# EAGLE design AccessPanelV3 (EAGLE 7.7.0)
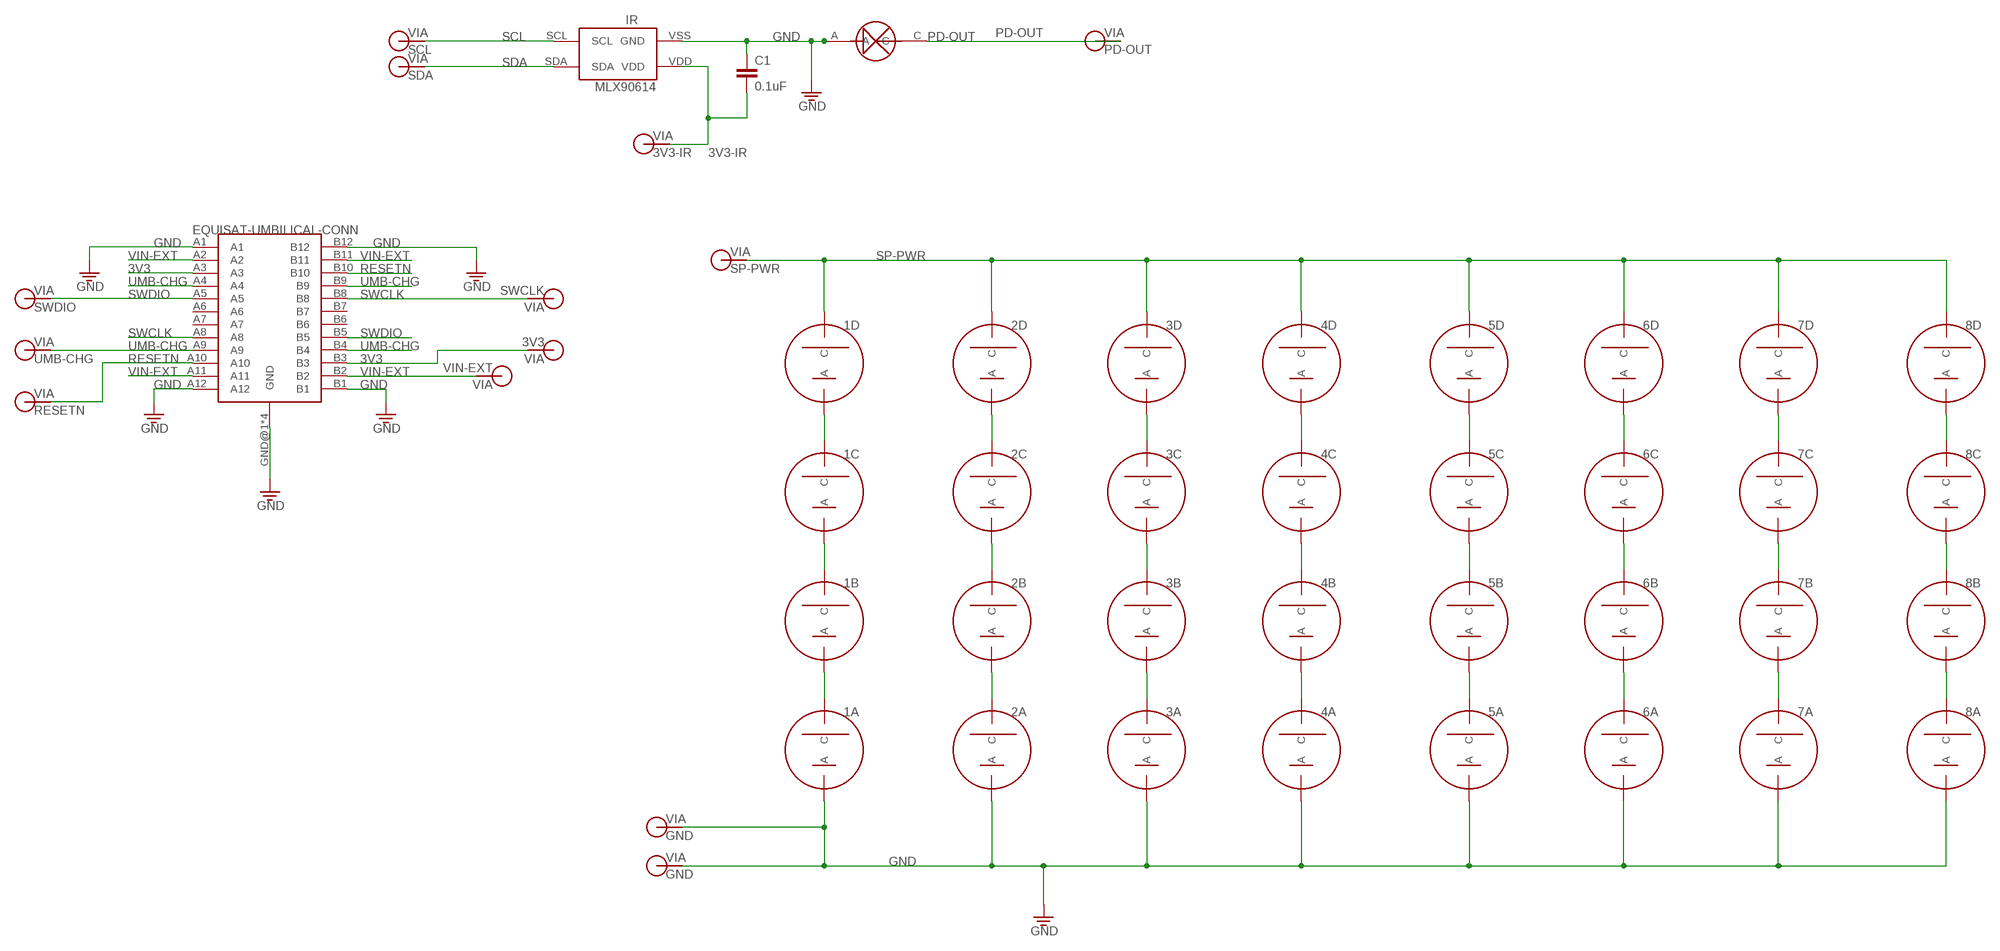
[diagram p0: schematic, sheet 1]

## Parts
1A  SOLARCELLV3  [TRISOLX-V3]
1B  SOLARCELLV3  [TRISOLX-V3]
1C  SOLARCELLV3  [TRISOLX-V3]
1D  SOLARCELLV3  [TRISOLX-V3]
2A  SOLARCELLV3  [TRISOLX-V3]
2B  SOLARCELLV3  [TRISOLX-V3]
2C  SOLARCELLV3  [TRISOLX-V3]
2D  SOLARCELLV3  [TRISOLX-V3]
3A  SOLARCELLV3  [TRISOLX-V3]
3B  SOLARCELLV3  [TRISOLX-V3]
3C  SOLARCELLV3  [TRISOLX-V3]
3D  SOLARCELLV3  [TRISOLX-V3]
4A  SOLARCELLV3  [TRISOLX-V3]
4B  SOLARCELLV3  [TRISOLX-V3]
4C  SOLARCELLV3  [TRISOLX-V3]
4D  SOLARCELLV3  [TRISOLX-V3]
5A  SOLARCELLV3  [TRISOLX-V3]
5B  SOLARCELLV3  [TRISOLX-V3]
5C  SOLARCELLV3  [TRISOLX-V3]
5D  SOLARCELLV3  [TRISOLX-V3]
6A  SOLARCELLV3  [TRISOLX-V3]
6B  SOLARCELLV3  [TRISOLX-V3]
6C  SOLARCELLV3  [TRISOLX-V3]
6D  SOLARCELLV3  [TRISOLX-V3]
7A  SOLARCELLV3  [TRISOLX-V3]
7B  SOLARCELLV3  [TRISOLX-V3]
7C  SOLARCELLV3  [TRISOLX-V3]
7D  SOLARCELLV3  [TRISOLX-V3]
8A  SOLARCELLV3  [TRISOLX-V3]
8B  SOLARCELLV3  [TRISOLX-V3]
8C  SOLARCELLV3  [TRISOLX-V3]
8D  SOLARCELLV3  [TRISOLX-V3]
C1  0.1uF  CAP0805  [0805]
IR  MXL90614  [MXL90620]
PD  TEMD6200  [TEMD6200]
SCL  SCL  VIA-60MIL  [VIA-60MIL]
SDA  SDA  VIA-60MIL  [VIA-60MIL]
UMB-CONN  EQUISAT-UMBILICAL-CONN  [USB-C-RCPT-SMT]
V1  SP-PWR  VIA-60MIL  [VIA-60MIL]
V2  GND  VIA-60MIL  [VIA-60MIL]
V3  3V3-IR  VIA-60MIL  [VIA-60MIL]
V4  GND  VIA-60MIL  [VIA-60MIL]
V5  UMB-CHG  VIA-60MIL  [VIA-60MIL]
V6  PD-OUT  VIA-60MIL  [VIA-60MIL]
V7  VIN-EXT  VIA-60MIL  [VIA-60MIL]
V8  RESETN  VIA-60MIL  [VIA-60MIL]
V9  3V3  VIA-60MIL  [VIA-60MIL]
V10  SWCLK  VIA-60MIL  [VIA-60MIL]
V11  SWDIO  VIA-60MIL  [VIA-60MIL]

## Nets
3V3: UMB-CONN.A3 UMB-CONN.B3 V9.P$1
3V3-IR: C1.2 IR.VDD V3.P$1
GND: 1A.ANODE(A) 2A.ANODE(A) 3A.ANODE(A) 4A.ANODE(A) 5A.ANODE(A) 6A.ANODE(A) 7A.ANODE(A) 8A.ANODE(A) C1.1 IR.VSS(GND) PD.A UMB-CONN.A1 UMB-CONN.A12 UMB-CONN.B1 UMB-CONN.B12 UMB-CONN.GND@1(GND) UMB-CONN.GND@2(GND) UMB-CONN.GND@3(GND) UMB-CONN.GND@4(GND) V2.P$1 V4.P$1
N$1: 1C.CATHODE(C) 1D.ANODE(A)
N$2: 2C.CATHODE(C) 2D.ANODE(A)
N$3: 3C.CATHODE(C) 3D.ANODE(A)
N$4: 4C.CATHODE(C) 4D.ANODE(A)
N$5: 5C.CATHODE(C) 5D.ANODE(A)
N$6: 6C.CATHODE(C) 6D.ANODE(A)
N$7: 1A.CATHODE(C) 1B.ANODE(A)
N$8: 2A.CATHODE(C) 2B.ANODE(A)
N$9: 3A.CATHODE(C) 3B.ANODE(A)
N$10: 4A.CATHODE(C) 4B.ANODE(A)
N$11: 5A.CATHODE(C) 5B.ANODE(A)
N$12: 6A.CATHODE(C) 6B.ANODE(A)
N$13: 1B.CATHODE(C) 1C.ANODE(A)
N$14: 2B.CATHODE(C) 2C.ANODE(A)
N$15: 3B.CATHODE(C) 3C.ANODE(A)
N$16: 4B.CATHODE(C) 4C.ANODE(A)
N$17: 5B.CATHODE(C) 5C.ANODE(A)
N$18: 6B.CATHODE(C) 6C.ANODE(A)
N$19: 7C.CATHODE(C) 7D.ANODE(A)
N$20: 7A.CATHODE(C) 7B.ANODE(A)
N$21: 7B.CATHODE(C) 7C.ANODE(A)
N$22: 8C.CATHODE(C) 8D.ANODE(A)
N$23: 8A.CATHODE(C) 8B.ANODE(A)
N$24: 8B.CATHODE(C) 8C.ANODE(A)
PD-OUT: PD.C V6.P$1
RESETN: UMB-CONN.A10 UMB-CONN.B10 V8.P$1
SCL: IR.SCL SCL.P$1
SDA: IR.SDA SDA.P$1
SP-PWR: 1D.CATHODE(C) 2D.CATHODE(C) 3D.CATHODE(C) 4D.CATHODE(C) 5D.CATHODE(C) 6D.CATHODE(C) 7D.CATHODE(C) 8D.CATHODE(C) V1.P$1
SWCLK: UMB-CONN.A8 UMB-CONN.B8 V10.P$1
SWDIO: UMB-CONN.A5 UMB-CONN.B5 V11.P$1
UMB-CHG: UMB-CONN.A4 UMB-CONN.A9 UMB-CONN.B4 UMB-CONN.B9 V5.P$1
VIN-EXT: UMB-CONN.A2 UMB-CONN.A11 UMB-CONN.B2 UMB-CONN.B11 V7.P$1
Unconnected: UMB-CONN.A6 UMB-CONN.A7 UMB-CONN.B6 UMB-CONN.B7

## Notes on the sheet
- GND | PD-OUT

## Library data of the parts
1A 1B 1C 1D 2A 2B 2C 2D 3A 3B 3C 3D 4A 4B 4C 4D 5A 5B 5C 5D 6A 6B 6C 6D 7A 7B 7C 7D 8A 8B 8C 8D = BrownSpaceEngineering:SOLARCELLV3
C1 = CNTRL_BOARD:CAP: Capacitor Standard 0603 ceramic capacitor, and 0.1" leaded capacitor.
IR = CNTRL_BOARD:MXL90614
PD = BrownSpaceEngineering:TEMD6200
SCL SDA V1-V11 = BrownSpaceEngineering:VIA
UMB-CONN = BrownSpaceEngineering:EQUISAT-UMBILICAL-CONN

## Board
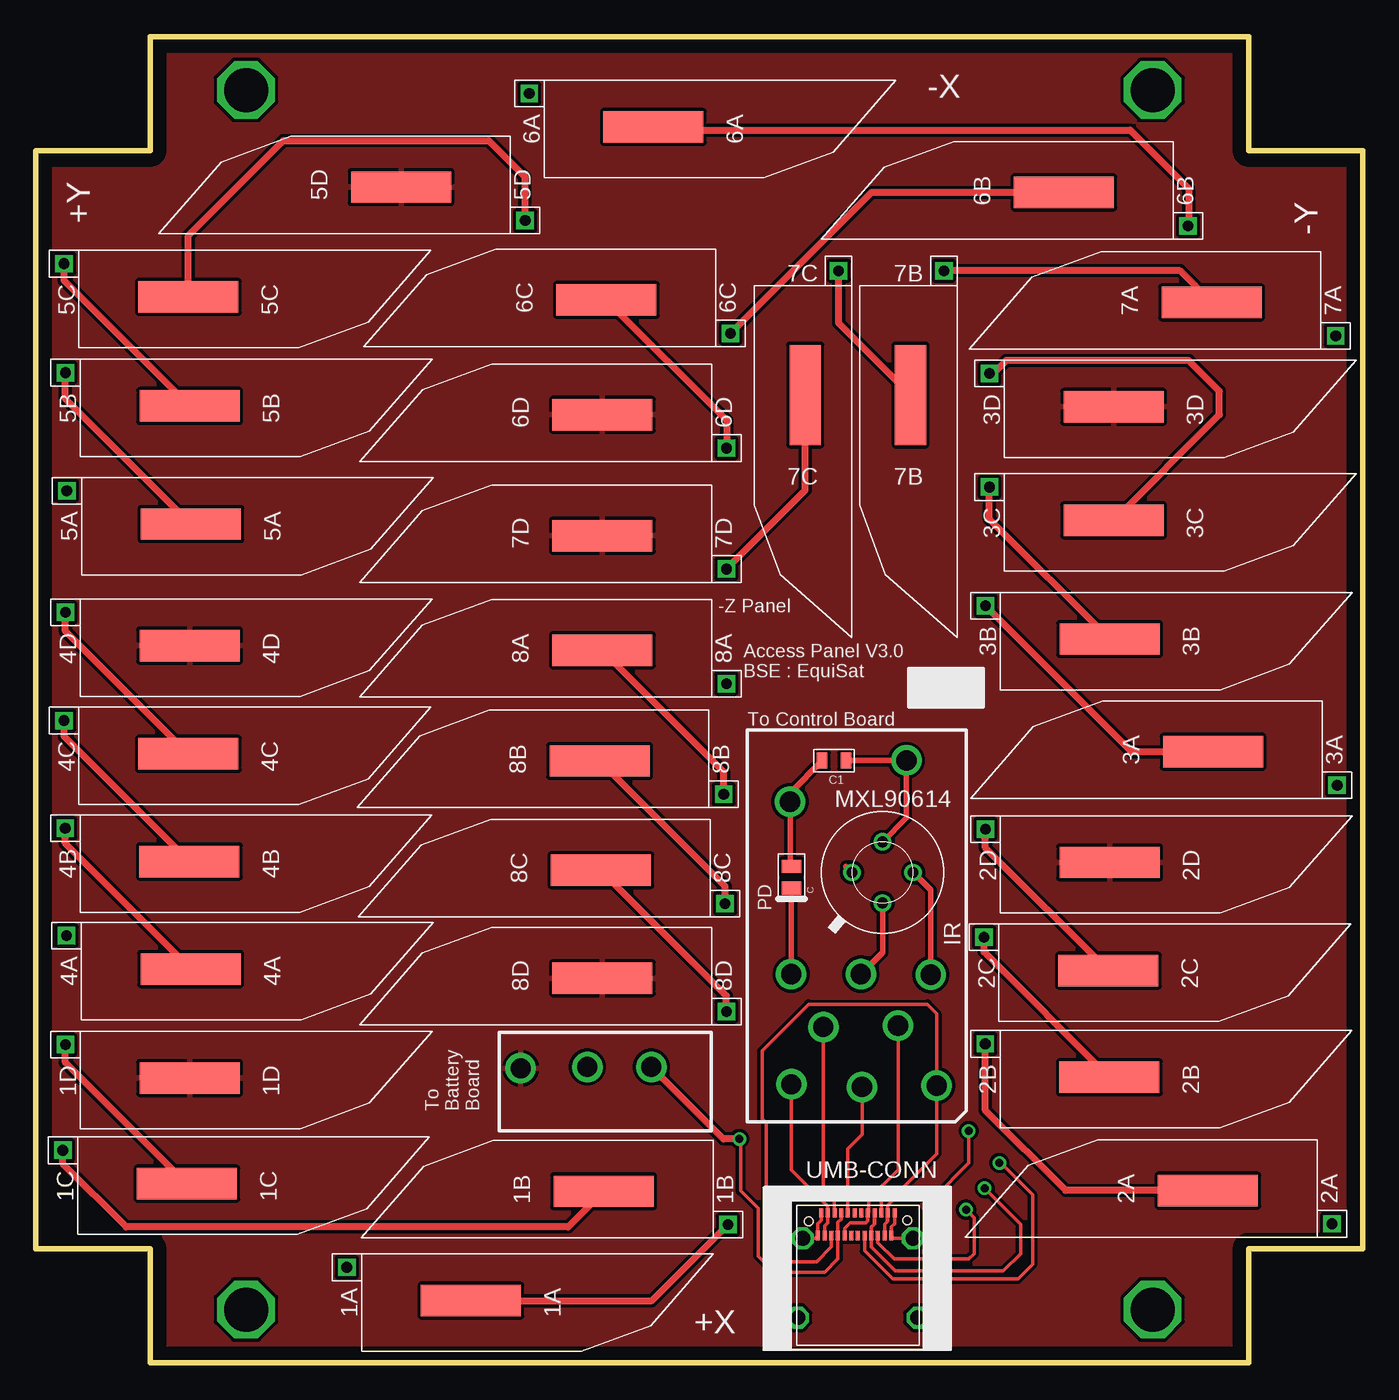
[diagram p1: board, top side]
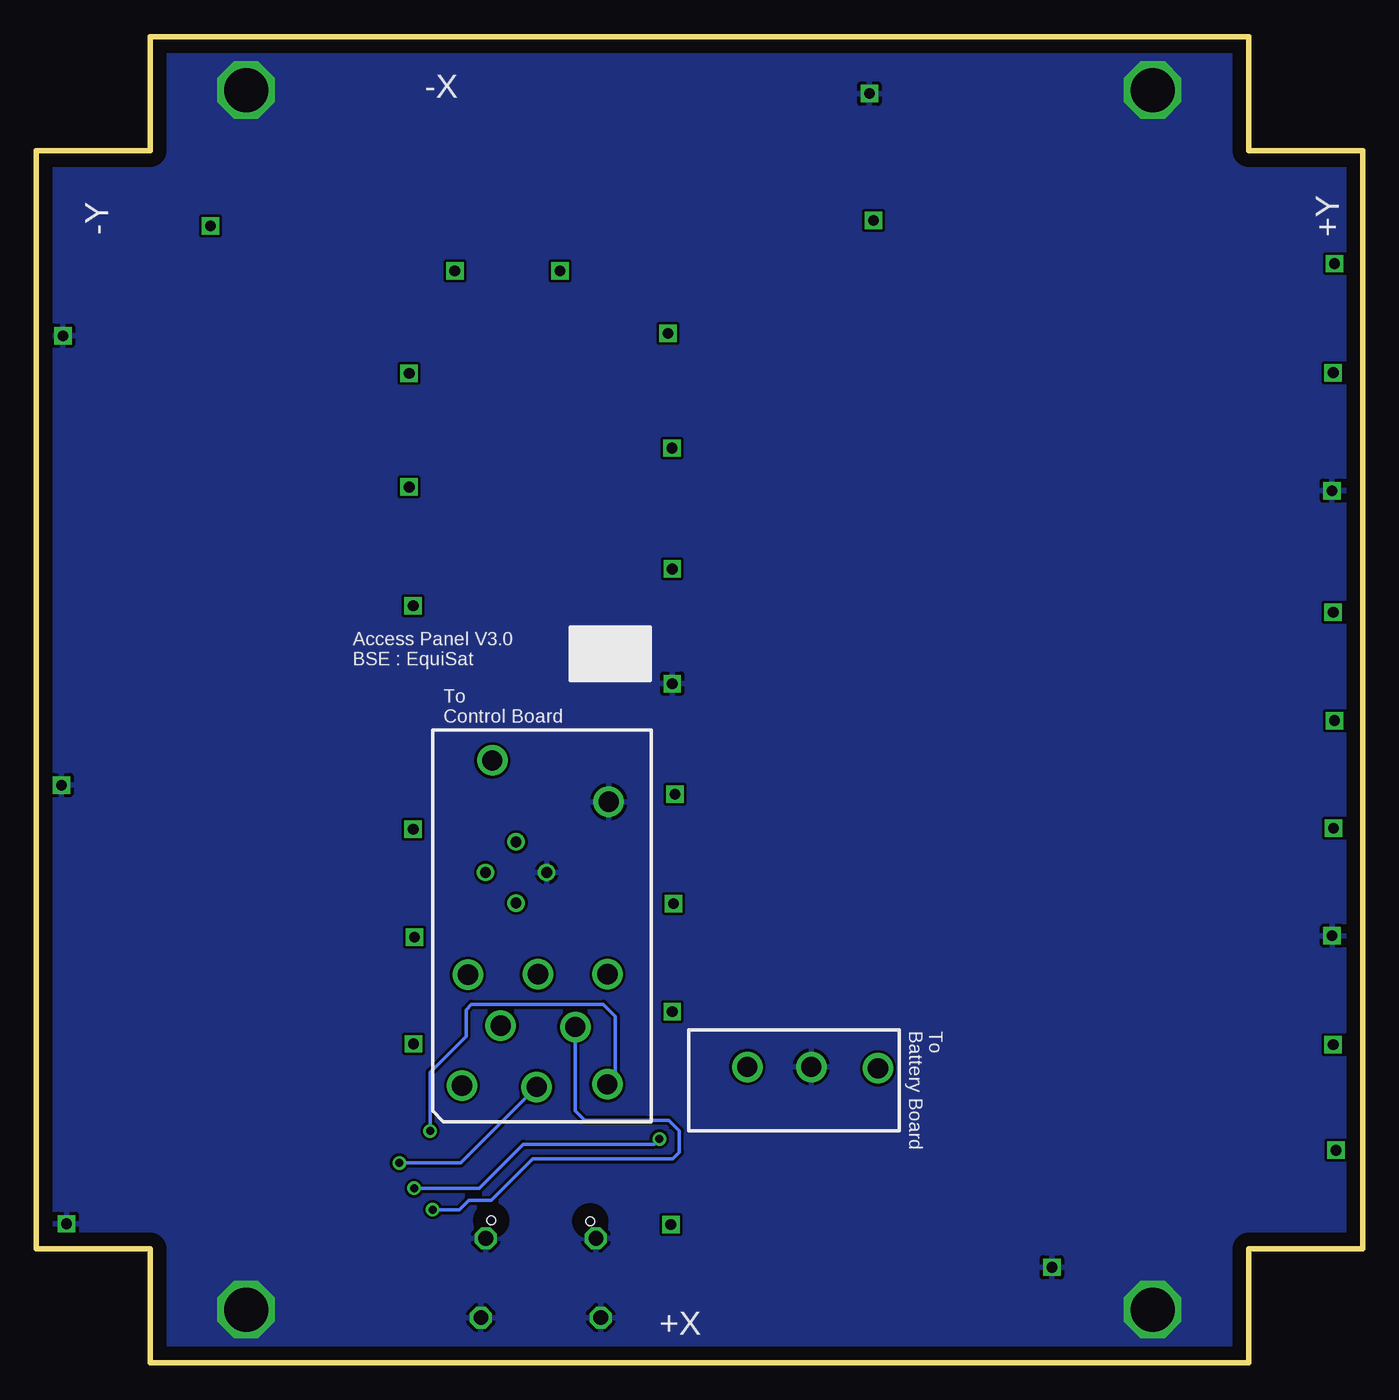
[diagram p2: board, bottom side, seen from below]

Size 99.5 x 99.5 mm. Coordinates in mm from the lower left corner, seen from the top.
Outline: 8.55,0 8.55,8.55 0,8.55 0,90.95 8.55,90.95 8.55,99.5 90.95,99.5 90.95,90.95 99.5,90.95 99.5,8.55 90.95,8.55 90.95,0 8.55,0
Copper layers (1*16): Top 0.035mm / dielectric 1.5mm / Bottom 0.035mm
Design rules "default": minimum track width 10mil, minimum drill 24mil, track to track 8mil, track to pad 8mil, pad to pad 8mil, via to via 8mil, smd to smd 8mil, copper to edge 40mil, drill to drill 8mil, minimum pad ring 10mil, minimum via ring 8mil, stop-mask expansion 4mil, vias tented up to drill 0mil, thermal gap 10mil

### Footprints (pad centres in the part's own frame; a part is rotated, then mirrored left to right if it is on the bottom)
TRISOLX-V3 = drill 0.8 square: ANODE 13.53,-1.54 | smd 7.5 x 2.35: CATHODE 4.22,0.96
0805 = smd 0.8 x 1.2: 1 -0.9,0; 2 0.9,0
MXL90620 = drill 0.8: SCL 2.293,0; VDD -2.293,0; VSS 0,-2.294 | drill 0.8 pad 1.2: SDA 0,2.294
TEMD6200 = smd 1 x 1.45: A 0.76,0.4; C -0.88,0.4
VIA-60MIL = drill 1.524: P$1 0,0
USB-C-RCPT-SMT = smd 0.3 x 0.7: A1 -2.75,0; A2 -2.25,0; A3 -1.75,0; A4 -1.25,0; A5 -0.75,0; A6 -0.25,0; A7 0.25,0; A8 0.75,0; A9 1.25,0; A10 1.75,0; A11 2.25,0; A12 2.75,0; B1 2.5,-1.7; B2 2,-1.7; B3 1.5,-1.7; B4 1,-1.7; B5 0.5,-1.7; B6 0,-1.7; B7 -0.5,-1.7; B8 -1,-1.7; B9 -1.5,-1.7; B10 -2,-1.7; B11 -2.5,-1.7; B12 -3,-1.7 | drill 1.1 pad 1.27 octagon: GND@1 -4.13,-1.91; GND@2 4.13,-1.91; GND@3 -4.49,-7.86; GND@4 4.49,-7.86 | hole 0.65: -3.7,-0.62; 3.72,-0.57

### Placement (x,y rotation side)
1A  36.84,5.63 180 top
1B  38.36,11.91 0 top
1C  15.54,14.41 180 top
1D  15.74,22.33 180 top
2A  83.68,11.97 0 top
2B  84.72,22.39 180 top
2C  84.64,30.39 180 top
2D  84.74,38.51 180 top
3A  84.06,44.89 0 top
3B  84.74,55.27 180 top
3C  85.04,64.17 180 top
3D  85.04,72.69 180 top
4A  15.82,30.51 180 top
4B  15.72,38.57 180 top
4C  15.64,46.65 180 top
4D  15.74,54.77 180 top
5A  15.84,63.89 180 top
5B  15.74,72.75 180 top
5C  15.64,80.93 180 top
5D  23.16,87.25 0 top
6A  50.52,93.69 180 top
6B  72.88,86.85 0 top
6C  38.56,78.79 0 top
6D  38.26,70.17 0 top
7A  83.95,78.6 0 top
7B  66.55,68.4 90 top
7C  58.65,68.4 90 top
7D  38.25,61.1 0 top
8A  38.25,52.5 0 top
8B  38.05,44.2 0 top
8C  38.15,36 0 top
8D  38.25,27.9 0 top
C1  59.85,45.18 0 top
IR  63.49,36.79 270 top
PD  57.06,36.49 90 top
SCL  61.86,29.16 180 top
SDA  67.11,29.13 180 top
UMB-CONN  61.64,11.26 0 top
V1  36.35,22.1 270 top
V2  41.35,22.2 270 top
V3  65.28,45.2 0 top
V4  56.55,42.1 90 top
V5  46.15,22.2 270 top
V6  56.64,29.16 180 top
V7  56.65,20.9 180 top
V8  67.55,20.8 180 top
V9  59.05,25.2 180 top
V10  64.65,25.3 180 top
V11  61.95,20.7 180 top

### Tracks (layer width: path | path; a pad name or v marks a point on that pad's centre or on a via)
3V3  (via drill 0.6)
  Top 0.254: UMB-CONN.A3 59.85,11.29 59.85,12.4 59.05,13.2 V9.P$1 | UMB-CONN.B3 63.14,9.01 64.35,7.8 69.95,7.8 70.35,8.2 70.35,10.9 v69.75,11.5
  Bottom 0.254: v69.75,11.5 67.75,11.5 67.05,12.2 65.35,12.2 62.25,15.3 51.75,15.3 51.25,15.8 51.25,17.4 52.05,18.2 58.35,18.2 59.05,18.9 V9.P$1
3V3-IR
  Top 0.406: C1.2 65.26,45.17 V3.P$1 65.28,40.87 IR.VDD
GND  (via drill 3.3)
  Top 0.254: UMB-CONN.GND@1 58.43,9.35 UMB-CONN.B12 58.64,10.45 58.89,10.7 UMB-CONN.A1 | UMB-CONN.A12 64.39,10.45 64.14,10.2 UMB-CONN.B1 64.35,9.35 UMB-CONN.GND@2
  Top 0.406: IR.VSS 60.74,37.25 | PD.A 56.55,37.35 V4.P$1 56.55,42.77 C1.1
  other vias: 15.75,95.5 83.75,95.5 83.75,4 15.75,4
  pour Bottom: -4.66,107.98 115.25,107.98 115.65,97.91 123.86,97.91 124.86,-15.1 -10.16,-15.1 -10.26,-14.24 -12.56,-14.24 -13.46,98.57 -4.26,98.57
N$1
  Top 0.508: 1C.CATHODE 2.21,22.56 1D.ANODE
N$2
  Top 0.508: 2C.CATHODE 71.21,38.64 2D.ANODE
N$3
  Top 0.508: 3C.CATHODE 88.75,71.14 88.75,72.9 86.45,75.2 72.75,75.2 71.78,74.23 3D.ANODE
N$4
  Top 0.508: 4C.CATHODE 2.21,54.9 4D.ANODE
N$5
  Top 0.508: 5C.CATHODE 11.42,84.57 18.55,91.7 33.95,91.7 36.65,89 36.65,85.75 5D.ANODE
N$6
  Top 0.508: 6C.CATHODE 51.79,70.74 6D.ANODE
N$7
  Top 0.508: 1A.CATHODE 46.19,4.67 1B.ANODE
N$8
  Top 0.508: 2A.CATHODE 77.22,12.93 71.19,18.96 2B.ANODE
N$9
  Top 0.508: 3A.CATHODE 82.17,45.85 3B.ANODE
N$10
  Top 0.508: 4A.CATHODE 2.19,38.96 4B.ANODE
N$11
  Top 0.508: 5A.CATHODE 2.21,72.34 5B.ANODE
N$12
  Top 0.508: 6A.CATHODE 46.53,92.5 82.05,92.5 86.45,88.1 86.45,85.35 6B.ANODE
N$13
  Top 0.508: 1B.CATHODE 39.91,10.2 6.75,10.2 2.01,14.94 1C.ANODE
N$14
  Top 0.508: 2B.CATHODE 71.11,30.82 2C.ANODE
N$15
  Top 0.508: 3B.CATHODE 71.51,63.32 3C.ANODE
N$16
  Top 0.508: 4B.CATHODE 2.11,47 4C.ANODE
N$17
  Top 0.508: 5B.CATHODE 2.11,81.2 5C.ANODE
N$18
  Top 0.508: 6B.CATHODE 62.65,87.81 6C.ANODE
N$19
  Top 0.508: 7D.ANODE 57.69,65.47 7C.CATHODE
N$20
  Top 0.508: 7A.CATHODE 85.8,81.93 7B.ANODE
N$21
  Top 0.508: 7B.CATHODE 60.19,78.02 7C.ANODE
N$22
  Top 0.508: 8D.ANODE 51.78,27.55 8C.CATHODE
N$23
  Top 0.508: 8B.ANODE 51.58,44.35 8A.CATHODE
N$24
  Top 0.508: 8C.ANODE 51.68,35.75 8B.CATHODE
N$25
  Top 0.25: 90.95,99.5 90.95,90.9 99.45,90.9 99.45,8.6 90.95,8.6 90.95,0 8.55,0 8.55,8.6 0.05,8.6 0.05,91 8.55,91 8.55,99.5 90.95,99.5
PD-OUT
  Top 0.406: PD.C 56.64,35.59 V6.P$1
RESETN
  Top 0.254: UMB-CONN.A10 63.4,12.23 64.27,13.1 64.95,13.1 67.55,15.7 V8.P$1 67.55,26.2 66.85,26.9 57.95,26.9 54.45,23.4 54.45,18.3 54.75,18 54.75,12.6 55.85,11.5 55.85,8.1 56.35,7.6 58.55,7.6 59.65,8.7 59.65,9.54 UMB-CONN.B10
SCL
  Top 0.406: SCL.P$1 63.49,30.79 IR.SCL
SDA
  Top 0.406: IR.SDA 67.11,35.47 SDA.P$1
SP-PWR
  pour Top (isolate 0.254, rank 2): 141.58,105.8 141.58,-31.08 -19.43,-26.28 -13.45,105.8
SWCLK
  Top 0.254: UMB-CONN.B8 60.64,10.09 61.05,10.5 62.22,10.5 62.39,10.67 UMB-CONN.A8 62.45,11.32 62.45,12.3 64.65,14.5 V10.P$1
SWDIO  (via drill 0.6)
  Top 0.254: UMB-CONN.A5 60.89,16.07 61.95,17.13 V11.P$1 | UMB-CONN.B5 62.15,9.54 62.15,8.4 64.25,6.3 73.65,6.3 74.75,7.4 74.75,12.6 72.35,15 v72.25,15
  Bottom 0.254: v72.25,15 67.65,15 V11.P$1
UMB-CHG  (via drill 0.6)
  Top 0.254: UMB-CONN.B9 60.14,10.13 60.14,10.53 | UMB-CONN.A4 60.39,10.78 60.14,10.53 | UMB-CONN.B4 62.64,10.17 62.88,10.41 62.88,11.25 UMB-CONN.A9 62.89,10.44 62.65,10.2 62.65,8.7 64.45,6.9 72.55,6.9 73.85,8.2 73.85,10.4 v71.15,13.1 | 60.14,10.53 60.14,7.79 59.15,6.8 55.35,6.8 54.15,8 54.15,11.6 52.85,12.9 52.85,16.7 v52.75,16.8
  Top 0.508: v52.75,16.8 51.55,16.8 V5.P$1
  Bottom 0.254: v71.15,13.1 66.25,13.1 62.95,16.4 53.15,16.4 v52.75,16.8
VIN-EXT  (via drill 0.6)
  Top 0.254: UMB-CONN.B11 59.14,10.28 59.38,10.52 59.38,11.25 UMB-CONN.A2 59.39,11.76 56.65,14.5 V7.P$1 | UMB-CONN.A11 63.89,10.64 63.65,10.4 UMB-CONN.B2 63.66,9.58 63.66,10.39 63.85,10.58 63.85,11.3 63.88,11.33 63.88,11.82 64.46,12.4 67.35,12.4 69.95,15 v69.95,17.4
  Bottom 0.254: v69.95,17.4 69.95,21.8 67.25,24.5 67.25,26.5 66.85,26.9 56.95,26.9 56.05,26 56.05,21 56.15,20.9 V7.P$1

### Text on the board
tPlace: -X | -Y | +Y | -Z Panel | Access Panel V3.0 / BSE : EquiSat | To Control Board | To / Battery / Board | +X
bPlace: -X | +Y | -Y | Access Panel V3.0 / BSE : EquiSat | To / Control Board | To / Battery Board | +X